# Altium schematic sheet JY02.SchDoc
size A4
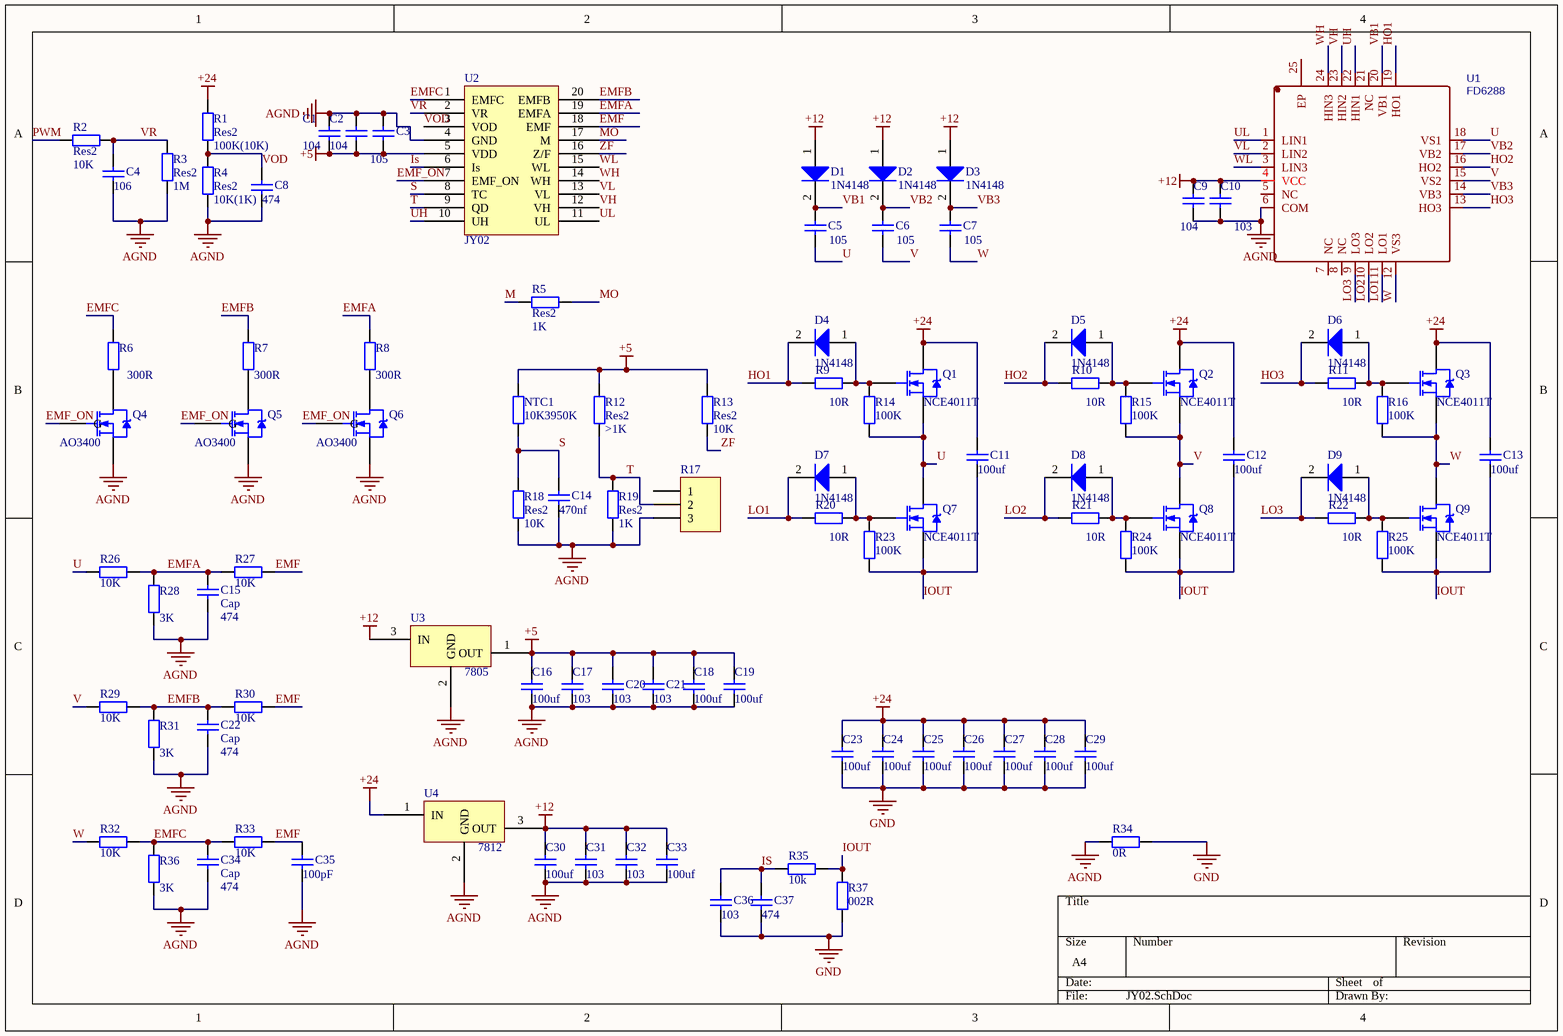
[diagram p0: JY02.SchDoc]

## Parts
C1  value 104  [0603C]  (hidden comment: Cap)
C2  value 104  [0603C]  (hidden comment: Cap)
C3  value 105  [0603C]  (hidden comment: Cap)
C4  value 106  [0603C]  (hidden comment: Cap)
C5  value 105  [0805C]  (hidden comment: Cap)
C6  value 105  [0805C]  (hidden comment: Cap)
C7  value 105  [0805C]  (hidden comment: Cap)
C8  value 474  [0603C]  (hidden comment: Cap)
C9  value 104  [0603C]  (hidden comment: Cap)
C10  value 103  [0603C]  (hidden comment: Cap)
C11  value 100uf  [0805C]  (hidden comment: Cap)
C12  value 100uf  [0805C]  (hidden comment: Cap)
C13  value 100uf  [0805C]  (hidden comment: Cap)
C14  value 470nf  [0603C]  (hidden comment: Cap)
C15  Cap  value 474  [0603C]
C16  value 100uf  [1206C]  (hidden comment: Cap)
C17  value 103  [0603C]  (hidden comment: Cap)
C18  value 100uf  [1206C]  (hidden comment: Cap)
C19  value 100uf  [1206C]  (hidden comment: Cap)
C20  value 103  [0603C]  (hidden comment: Cap)
C21  value 103  [0603C]  (hidden comment: Cap)
C22  Cap  value 474  [0603C]
C23  value 100uf  [1206C]  (hidden comment: Cap)
C24  value 100uf  [1206C]  (hidden comment: Cap)
C25  value 100uf  [1206C]  (hidden comment: Cap)
C26  value 100uf  [1206C]  (hidden comment: Cap)
C27  value 100uf  [1206C]  (hidden comment: Cap)
C28  value 100uf  [1206C]  (hidden comment: Cap)
C29  value 100uf  [1206C]  (hidden comment: Cap)
C30  value 100uf  [1206C]  (hidden comment: Cap)
C31  value 103  [0603C]  (hidden comment: Cap)
C32  value 103  [0603C]  (hidden comment: Cap)
C33  value 100uf  [1206C]  (hidden comment: Cap)
C34  Cap  value 474  [0603C]
C35  value 100pF  [0603C]  (hidden comment: Cap)
C36  value 103  [0603C]  (hidden comment: Cap)
C37  value 474  [0603C]  (hidden comment: Cap)
D1  1N4148  [SOD323-d]
D2  1N4148  [SOD323-d]
D3  1N4148  [SOD323-d]
D4  1N4148  [SOD323-d]
D5  1N4148  [SOD323-d]
D6  1N4148  [SOD323-d]
D7  1N4148  [SOD323-d]
D8  1N4148  [SOD323-d]
D9  1N4148  [SOD323-d]
NTC1  value 10K3950K  [0603R]  (hidden comment: Res2)
Q1  NCE4011T  [DFN5X6-8L]
Q2  NCE4011T  [DFN5X6-8L]
Q3  NCE4011T  [DFN5X6-8L]
Q4  AO3400  [SOT23-3_AO3400]
Q5  AO3400  [SOT23-3_AO3400]
Q6  AO3400  [SOT23-3_AO3400]
Q7  NCE4011T  [DFN5X6-8L]
Q8  NCE4011T  [DFN5X6-8L]
Q9  NCE4011T  [DFN5X6-8L]
R1  Res2  value 100K(10K)  [0603R]
R2  Res2  value 10K  [0603R]
R3  Res2  value 1M  [0603R]
R4  Res2  value 10K(1K)  [0603R]
R5  Res2  value 1K  [0603R]
R6  value 300R  [0603R]  (hidden comment: Res2)
R7  value 300R  [0603R]  (hidden comment: Res2)
R8  value 300R  [0603R]  (hidden comment: Res2)
R9  value 10R  [0805R]  (hidden comment: Res2)
R10  value 10R  [0805R]  (hidden comment: Res2)
R11  value 10R  [0805R]  (hidden comment: Res2)
R12  Res2  value >1K  [0603R]
R13  Res2  value 10K  [0603R]
R14  value 100K  [0603R]  (hidden comment: Res2)
R15  value 100K  [0603R]  (hidden comment: Res2)
R16  value 100K  [0603R]  (hidden comment: Res2)
R17  Header 3  [HDR1X3]  (value not drawn)
R18  Res2  value 10K  [0603R]
R19  Res2  value 1K  [0603R]
R20  value 10R  [0805R]  (hidden comment: Res2)
R21  value 10R  [0805R]  (hidden comment: Res2)
R22  value 10R  [0805R]  (hidden comment: Res2)
R23  value 100K  [0603R]  (hidden comment: Res2)
R24  value 100K  [0603R]  (hidden comment: Res2)
R25  value 100K  [0603R]  (hidden comment: Res2)
R26  value 10K  [0603R]  (hidden comment: Res2)
R27  value 10K  [0603R]  (hidden comment: Res2)
R28  value 3K  [0603R]  (hidden comment: Res2)
R29  value 10K  [0603R]  (hidden comment: Res2)
R30  value 10K  [0603R]  (hidden comment: Res2)
R31  value 3K  [0603R]  (hidden comment: Res2)
R32  value 10K  [0603R]  (hidden comment: Res2)
R33  value 10K  [0603R]  (hidden comment: Res2)
R34  value 0R  [0805R]  (hidden comment: Res2)
R35  value 10k  [0603R]  (hidden comment: Res2)
R36  value 3K  [0603R]  (hidden comment: Res2)
R37  value 002R  [2512R]  (hidden comment: Res2)
U1  FD6288  [QFN-24]
U2  JY02  [SSOP20-25-150-1]
U3  7805  [SOT89]
U4  7812  [TO252-3]

## Nets
+5: C1.1 C2.1 C3.1 C16.1 C17.2 C18.1 C19.1 C20.2 C21.2 NTC1.1 R12.1 R13.1 U2.5(VDD) U3.1(OUT)
+12: C9.2 C10.2 C30.1 C31.2 C32.2 C33.1 D1.1(A) D2.1(A) D3.1(A) U1.4(VCC) U3.3(IN) U4.3(OUT)
+24: C11.2 C12.2 C13.2 C23.1 C24.1 C25.1 C26.1 C27.1 C28.1 C29.1 Q1.2(D) Q2.2(D) Q3.2(D) R1.1 U4.1(IN)
AGND: C1.2 C2.2 C3.2 C4.1 C8.1 C9.1 C10.1 C14.1 C15.1 C16.2 C17.1 C18.2 C19.2 C20.1 C21.1 C22.1 C30.2 C31.1 C32.1 C33.2 C34.1 C35.1 Q4.2(S) Q5.2(S) Q6.2(S) R3.2 R4.2 R17.3 R18.2 R19.2 R28.1 R31.1 R34.2 R36.1 U1.6(COM) U2.4(GND) U3.2(GND) U4.2(GND)
GND: C23.2 C24.2 C25.2 C26.2 C27.2 C28.2 C29.2 C36.1 C37.1 R34.1 R37.2
EMF: C35.2 R27.1 R30.1 R33.1 U2.18(EMF)
EMF_ON: Q4.1(G) Q5.1(G) Q6.1(G) U2.7(EMF_ON)
EMFA: C15.2 R8.2 R26.1 R27.2 R28.2 U2.19(EMFA)
EMFB: C22.2 R7.2 R29.1 R30.2 R31.2 U2.20(EMFB)
EMFC: C34.2 R6.2 R32.1 R33.2 R36.2 U2.1(EMFC)
HO1: D4.2(K) R9.2 U1.19(HO1)
HO2: D5.2(K) R10.2 U1.16(HO2)
HO3: D6.2(K) R11.2 U1.13(HO3)
IOUT: C11.1 C12.1 C13.1 Q7.3(S) Q8.3(S) Q9.3(S) R23.1 R24.1 R25.1 R35.2 R37.1
Is: C36.2 C37.2 R35.1 U2.6(Is)
LO1: D7.2(K) R20.2 U1.11(LO1)
LO2: D8.2(K) R21.2 U1.10(LO2)
LO3: D9.2(K) R22.2 U1.9(LO3)
M: R5.2
MO: R5.1 U2.17(M)
PWM: R2.2
S: C14.2 NTC1.2 R18.1 U2.8(TC)
T: R12.2 R17.2 R19.1 U2.9(QD)
U: C5.1 Q1.3(S) Q7.2(D) R14.1 R26.2 U1.18(VS1)
UH: U1.22(HIN1) U2.10(UH)
UL: U1.1(LIN1) U2.11(UL)
V: C6.1 Q2.3(S) Q8.2(D) R15.1 R29.2 U1.15(VS2)
VB1: C5.2 D1.2(K) U1.20(VB1)
VB2: C6.2 D2.2(K) U1.17(VB2)
VB3: C7.2 D3.2(K) U1.14(VB3)
VH: U1.23(HIN2) U2.12(VH)
VL: U1.2(LIN2) U2.13(VL)
VOD: C8.2 R1.2 R4.1 U2.3(VOD)
VR: C4.2 R2.1 R3.1 U2.2(VR)
W: C7.1 Q3.3(S) Q9.2(D) R16.1 R32.2 U1.12(VS3)
WH: U1.24(HIN3) U2.14(WH)
WL: U1.3(LIN3) U2.15(WL)
ZF: R13.2 U2.16(Z/F)
NetD4_1: D4.1(A) Q1.1(G) R9.1 R14.2
NetD5_1: D5.1(A) Q2.1(G) R10.1 R15.2
NetD6_1: D6.1(A) Q3.1(G) R11.1 R16.2
NetD7_1: D7.1(A) Q7.1(G) R20.1 R23.2
NetD8_1: D8.1(A) Q8.1(G) R21.1 R24.2
NetD9_1: D9.1(A) Q9.1(G) R22.1 R25.2
NetQ4_3: Q4.3(D) R6.1
NetQ5_3: Q5.3(D) R7.1
NetQ6_3: Q6.3(D) R8.1

Not connected (* = marked no-connect by the designer): R17 1; U1 5(NC) 7(NC) 8(NC) 21(NC) 25(EP)

## Library data of the parts
C1-C37 = Cap: Capacitor; Published: 8-Jun-2000; LatestRevisionDate: 17-Jul-2002; LatestRevisionNote: Re-released for DXP Platform.; PackageReference: RAD-0.3; Publisher: Altium Limited; PackageDescription: Radial Cap, Thru-Hole; 2 Leads; 0.3 in Pin Spacing
D1-D9 = Diode 1N4148: High Conductance Fast Diode; Published: 8-Jun-2000; LatestRevisionDate: 17-Jul-2002; LatestRevisionNote: Re-released for DXP Platform.; DatasheetVersion: 1997; PackageReference: DO-35; Publisher: Altium Limited; PackageDescription: Diode, Axial; Body 3.8 x 1.9 mm (LxDia. max), Lead Dia. 0.53 mm (max); Code_JEDEC: DO-204-AH; ComponentLink1Description: Manufacturer Link; ComponentLink1URL: http://www.fairchildsemi.com/; ComponentLink2Description: Datasheet; ComponentLink2URL: http://www.fairchildsemi.com/ds/1N%2F1N4148.pdf
NTC1 R1-R16 R18-R37 = Res2: Resistor; Published: 8-Jun-2000; LatestRevisionDate: 17-Jul-2002; LatestRevisionNote: Re-released for DXP Platform.; PackageReference: AXIAL-0.4; Publisher: Altium Limited; PackageDescription: Axial Device, Thru-Hole; 2 Leads; 0.4 in Pin Spacing
Q1-Q9 = NMOS-2: N-Channel Power MOSFET; Note: Pin 2 is electrically connected to pin 4.; Published: 8-Jun-2000; LatestRevisionDate: 17-Jul-2002; LatestRevisionNote: Re-released for DXP Platform.; DatasheetVersion: PD-9.814; PackageVersion: Feb-1997; PackageReference: TO-220AB; Publisher: Altium Limited; PackageDescription: TO, Thru-Hole, Vertical, Heatsink Mounted; 3 In-Line Leads; Pitch 2.54 mm; ComponentLink1Description: Manufacturer Link; ComponentLink1URL: http://www.irf.com/
R17 = Header 3: Header, 3-Pin; LatestRevisionDate: 17-Jul-2002; LatestRevisionNote: Re-released for DXP Platform.; Publisher: Altium Limited
U1 = FD6288Q_C328453: BOM_Manufacturer: Fortior Tech; Contributor: LCSC; BOM_Supplier: LCSC; BOM_Supplier Part: C328453; BOM_Manufacturer Part: FD6288Q; spicePre: U; spiceSymbolName: FD6288Q_C328453
U3 U4 = 78XX